# Altium schematic sheet Buck_TPSM82913_5V5.SchDoc
size B; SheetNumber: 7; SheetTotal: 12
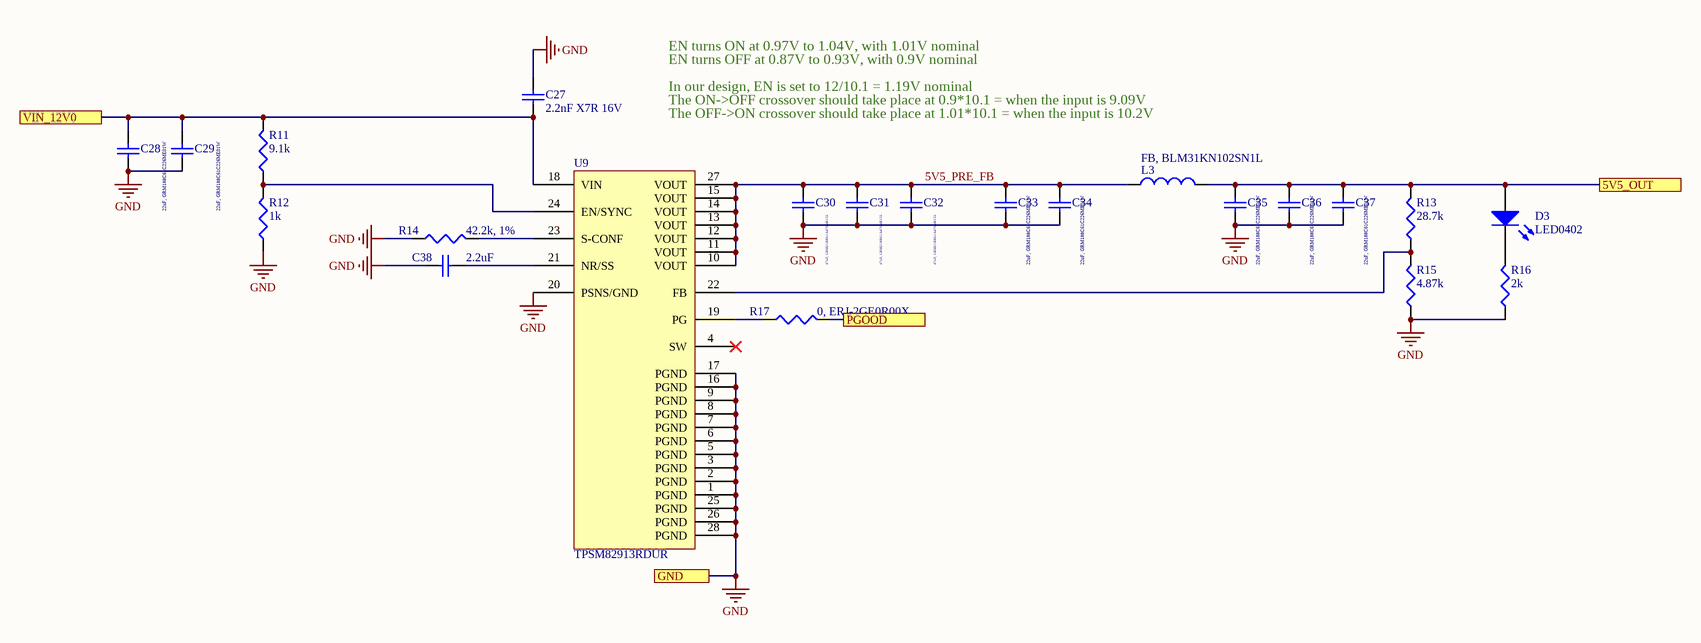
[diagram p0: Buck_TPSM82913_5V5.SchDoc]

## Parts
C27  2.2nF X7R 16V  [SMD-0402]
C28  22uF, GRM188C61C226ME01W  [SMD-0603]
C29  22uF, GRM188C61C226ME01W  [SMD-0603]
C30  47uF, GRM21BR61A476ME15L  [SMD-0805]
C31  47uF, GRM21BR61A476ME15L  [SMD-0805]
C32  47uF, GRM21BR61A476ME15L  [SMD-0805]
C33  22uF, GRM188C61C226ME01W  [SMD-0603]
C34  22uF, GRM188C61C226ME01W  [SMD-0603]
C35  22uF, GRM188C61C226ME01W  [SMD-0603]
C36  22uF, GRM188C61C226ME01W  [SMD-0603]
C37  22uF, GRM188C61C226ME01W  [SMD-0603]
C38  2.2uF  [SMD-0402]
D3  LED0402  [LED-0402]
L3  FB, BLM31KN102SN1L  [SMD-1206]
R11  9.1k  [SMD-0402]
R12  1k  [SMD-0402]
R13  28.7k  [SMD-0402]
R14  42.2k, 1%  [SMD-0402]
R15  4.87k  [SMD-0402]
R16  2k  [SMD-0402]
R17  0, ERJ-2GE0R00X  [SMD-0402]
U9  TPSM82913RDUR  [TPSM82913DRUR]

## Ports
5V5_OUT, GND, PGOOD, VIN_12V0

## Nets
GND: C27.2 C28.1 C29.1 C30.1 C31.1 C32.1 C33.1 C34.1 C35.1 C36.1 C37.1 C38.1 R12.1 R14.1 R15.1 R16.1 U9.1(PGND) U9.2(PGND) U9.3(PGND) U9.5(PGND) U9.6(PGND) U9.7(PGND) U9.8(PGND) U9.9(PGND) U9.16(PGND) U9.17(PGND) U9.20(PSNS/GND) U9.25(PGND) U9.26(PGND) U9.28(PGND) ; port GND
5V5_OUT: C35.2 C36.2 C37.2 D3.2(A) L3.2 R13.2 ; port 5V5_OUT
5V5_PRE_FB: C30.2 C31.2 C32.2 C33.2 C34.2 L3.1 U9.10(VOUT) U9.11(VOUT) U9.12(VOUT) U9.13(VOUT) U9.14(VOUT) U9.15(VOUT) U9.27(VOUT)
PGOOD: R17.2 ; port PGOOD
VIN_12V0: C27.1 C28.2 C29.2 R11.2 U9.18(VIN) ; port VIN_12V0
NetC38_2: C38.2 U9.21(NR/SS)
NetD3_1: D3.1(K) R16.2
NetR11_1: R11.1 R12.2 U9.24(EN/SYNC)
NetR13_1: R13.1 R15.2 U9.22(FB)
NetR14_2: R14.2 U9.23(S-CONF)
NetR17_1: R17.1 U9.19(PG)

Not connected (* = marked no-connect by the designer): U9 4(SW)*

## Notes on the sheet
- EN turns OFF at 0.87V to 0.93V, with 0.9V nominal
- EN turns ON at 0.97V to 1.04V, with 1.01V nominal
- In our design, EN is set to 12/10.1 = 1.19V nominal
- The ON->OFF crossover should take place at 0.9*10.1 = when the input is 9.09V
- The OFF->ON crossover should take place at 1.01*10.1 = when the input is 10.2V

## Library data of the parts
C27 C38 = CAP0402: Ceramic Capacitor 0402
C28 C29 C33-C37 = CAP0603: Ceramic Capacitor 0603
C30-C32 = CAP0805: Ceramic Capacitor 0805 Imperial (2012 Metric)
D3 = LED0402: LED 0402
L3 = L1206: Inductor 1206
R11-R17 = RES0402: Resistor-0402
U9 = TPSM82913RDU